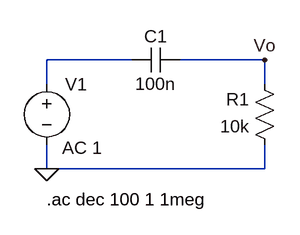
[diagram p0: schematic PasaAltos.asc]
PasaAltos.asc, the LTspice schematic file:
Version 4
SHEET 1 880 680
WIRE 128 112 16 112
WIRE 304 112 192 112
WIRE 16 144 16 112
WIRE 304 144 304 112
WIRE 16 256 16 224
WIRE 304 256 304 224
WIRE 304 256 16 256
FLAG 16 256 0
FLAG 304 112 Vo
SYMBOL voltage 16 128 R0
WINDOW 123 20 100 Left 2
WINDOW 39 0 0 Left 0
SYMATTR Value2 AC 1
SYMATTR InstName V1
SYMATTR Value ""
SYMBOL res 320 240 R180
WINDOW 0 36 76 Left 2
WINDOW 3 36 40 Left 2
SYMATTR InstName R1
SYMATTR Value 10k
SYMBOL cap 192 96 R90
WINDOW 0 0 32 VBottom 2
WINDOW 3 32 32 VTop 2
SYMATTR InstName C1
SYMATTR Value 100n
TEXT 16 296 Left 2 !.ac dec 100 1 1meg

The netlist it stands for:
* PasaAltos.asc
V1 N001 0 AC 1
R1 0 Vo 10k
C1 Vo N001 100n
.ac dec 100 1 1meg
.backanno
.end

* Results of the author's LTspice run, read from the files saved beside the schematic
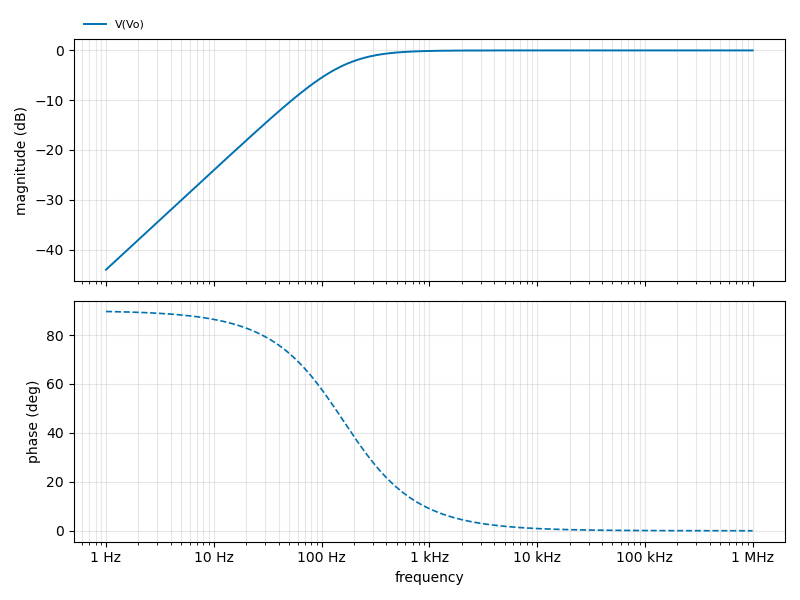
[diagram p1: AC Analysis of PasaAltos.asc, plotted from the saved traces]
* AC Analysis, 1 run:
*   V(Vo): -44.04 dB at 1 Hz, -0.00 dB at 1 MHz, peak -0.00 dB at 1 MHz, 3 dB below the peak at 159.2 Hz